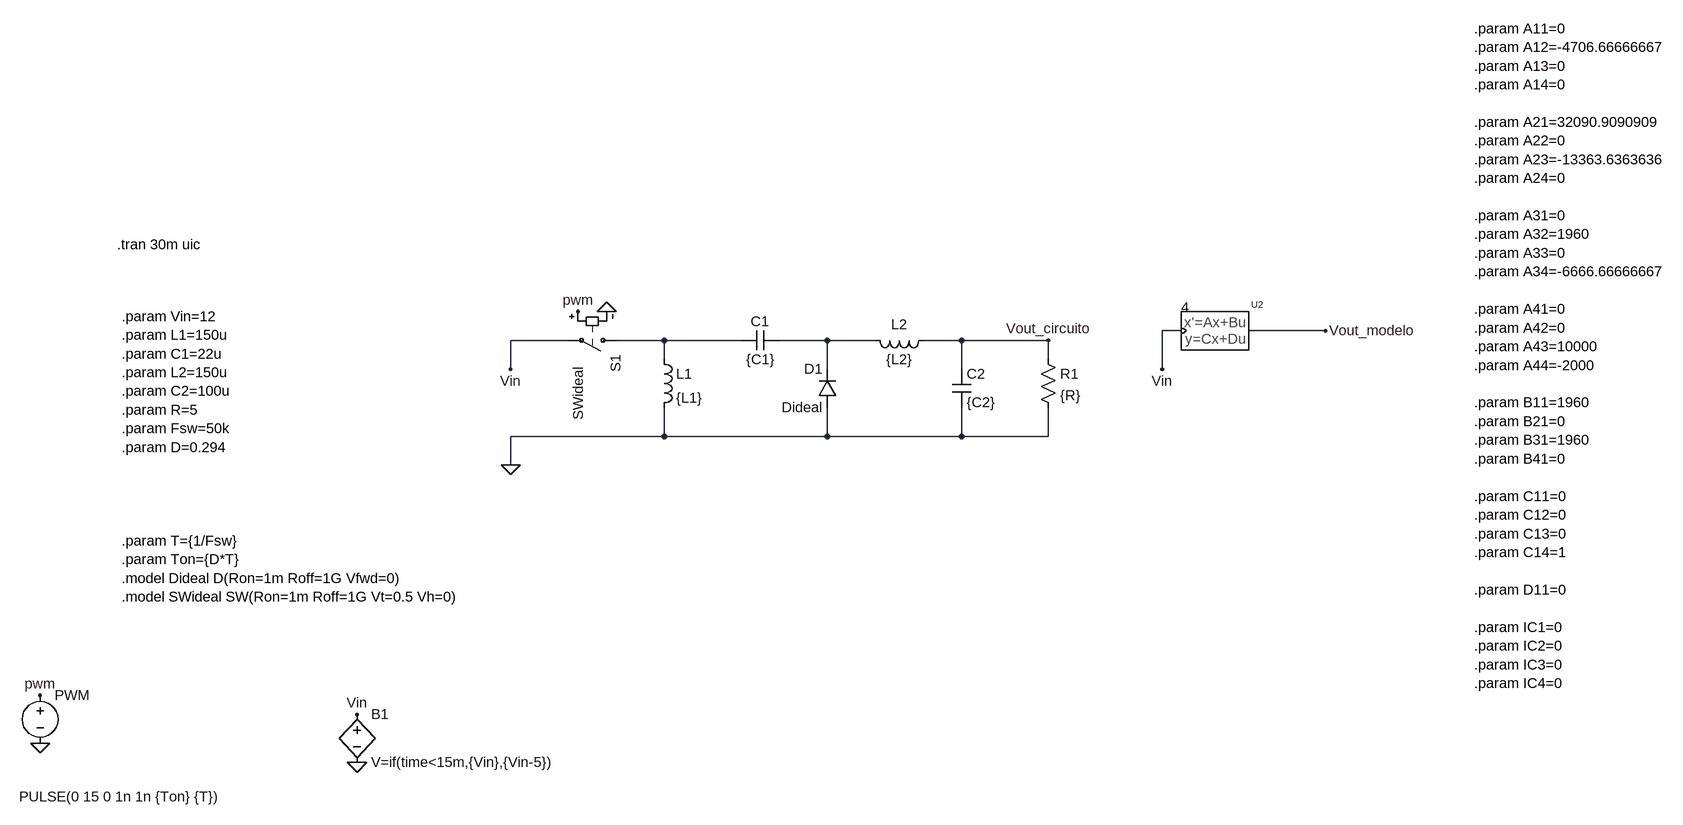
[diagram p0: schematic zeta.asc]
zeta.asc, the LTspice schematic file:
Version 4
SHEET 1 2188 876
WIRE 1184 80 1152 80
WIRE 1424 80 1296 80
WIRE -208 96 -304 96
WIRE -48 96 -128 96
WIRE 80 96 -48 96
WIRE 224 96 144 96
WIRE 304 96 224 96
WIRE 448 96 384 96
WIRE 592 96 448 96
WIRE -48 128 -48 96
WIRE 592 128 592 96
WIRE -304 144 -304 96
WIRE 224 144 224 96
WIRE 448 144 448 96
WIRE 1152 144 1152 80
WIRE -48 256 -48 208
WIRE -48 256 -304 256
WIRE 224 256 224 208
WIRE 224 256 -48 256
WIRE 448 256 448 208
WIRE 448 256 224 256
WIRE 592 256 592 208
WIRE 592 256 448 256
WIRE -304 304 -304 256
FLAG -304 304 0
FLAG -1088 688 pwm
FLAG -1088 768 0
FLAG 592 96 Vout_circuito
FLAG 1424 80 Vout_modelo
FLAG -144 48 0
FLAG -192 48 pwm
FLAG -304 144 Vin
FLAG 1152 144 Vin
FLAG -560 800 0
FLAG -560 720 Vin
SYMBOL diode 240 208 R180
WINDOW 0 24 64 Left 2
WINDOW 3 24 0 Left 2
SYMATTR InstName D1
SYMATTR Value Dideal
SYMBOL ind -64 112 R0
SYMATTR InstName L1
SYMATTR Value {L1}
SYMBOL cap 80 112 R270
WINDOW 0 32 32 VTop 2
WINDOW 3 0 32 VBottom 2
SYMATTR InstName C1
SYMATTR Value {C1}
SYMBOL voltage -1088 672 R0
WINDOW 3 -35 185 Left 2
WINDOW 123 0 0 Left 0
WINDOW 39 0 0 Left 0
SYMATTR Value PULSE(0 15 0 1n 1n {Ton} {T})
SYMATTR InstName PWM
SYMBOL res 576 112 R0
SYMATTR InstName R1
SYMATTR Value {R}
SYMBOL sw -112 96 R90
WINDOW 3 133 79 Right 2
SYMATTR Value SWideal
SYMATTR InstName S1
SYMBOL bv -560 704 R0
SYMATTR InstName B1
SYMATTR Value V=if(time<15m,{Vin},{Vin-5})
SYMBOL ind 400 80 R90
WINDOW 0 5 56 VBottom 2
WINDOW 3 32 56 VTop 2
SYMATTR InstName L2
SYMATTR Value {L2}
SYMBOL cap 432 144 R0
SYMATTR InstName C2
SYMATTR Value {C2}
SYMBOL StateSpace4 1248 80 R0
SYMATTR InstName U2
TEXT -952 56 Left 2 !.param Vin=12\n.param L1=150u\n.param C1=22u\n.param L2=150u\n.param C2=100u\n.param R=5\n.param Fsw=50k\n.param D=0.294\n \n \n \n \n.param T={1/Fsw}\n.param Ton={D*T}\n.model Dideal D(Ron=1m Roff=1G Vfwd=0)\n.model SWideal SW(Ron=1m Roff=1G Vt=0.5 Vh=0)
TEXT -960 -64 Left 2 !.tran 30m uic
TEXT 1840 -424 Left 2 !.param A11=0\n.param A12=-4706.66666667\n.param A13=0\n.param A14=0\n \n.param A21=32090.9090909\n.param A22=0\n.param A23=-13363.6363636\n.param A24=0\n \n.param A31=0\n.param A32=1960\n.param A33=0\n.param A34=-6666.66666667\n \n.param A41=0\n.param A42=0\n.param A43=10000\n.param A44=-2000\n \n.param B11=1960\n.param B21=0\n.param B31=1960\n.param B41=0\n \n.param C11=0\n.param C12=0\n.param C13=0\n.param C14=1\n \n.param D11=0\n \n.param IC1=0\n.param IC2=0\n.param IC3=0\n.param IC4=0

The netlist it stands for:
* zeta.asc
D1 0 N002 Dideal
L1 N001 0 {L1}
C1 N001 N002 {C1}
V§PWM pwm 0 PULSE(0 15 0 1n 1n {Ton} {T})
R1 Vout_circuito 0 {R}
S1 N001 Vin pwm 0 SWideal
B1 Vin 0 V=if(time<15m,{Vin},{Vin-5})
L2 Vout_circuito N002 {L2}
C2 Vout_circuito 0 {C2}
XU2 Vin Vout_modelo 4 A11={A11} A12={A12} A13={A13} A14={A14} B11={B11} A21={A21} A22={A22} A23={A23} A24={A24} B21={B21} A31={A31} A32={A32} A33={A33} A34={A34} B31={B31} A41={A41} A42={A42} A43={A43} A44={A44} B41={B41} C11={C11} C12={C12} C13={C13} C14={C14} D11={D11} ic1={IC1} ic2={IC2} ic3={IC3} ic4={IC4}  ; pins in out
.model D D
.lib standard.dio
.param Vin=12
.param L1=150u
.param C1=22u
.param L2=150u
.param C2=100u
.param R=5
.param Fsw=50k
.param D=0.294
.param T={1/Fsw}
.param Ton={D*T}
.model Dideal D(Ron=1m Roff=1G Vfwd=0)
.model SWideal SW(Ron=1m Roff=1G Vt=0.5 Vh=0)
.tran 30m uic
.param A11=0
.param A12=-4706.66666667
.param A13=0
.param A14=0
.param A21=32090.9090909
.param A22=0
.param A23=-13363.6363636
.param A24=0
.param A31=0
.param A32=1960
.param A33=0
.param A34=-6666.66666667
.param A41=0
.param A42=0
.param A43=10000
.param A44=-2000
.param B11=1960
.param B21=0
.param B31=1960
.param B41=0
.param C11=0
.param C12=0
.param C13=0
.param C14=1
.param D11=0
.param IC1=0
.param IC2=0
.param IC3=0
.param IC4=0
.lib statespace.sub
.backanno
.end

* Results of the author's LTspice run, read from the files saved beside the schematic
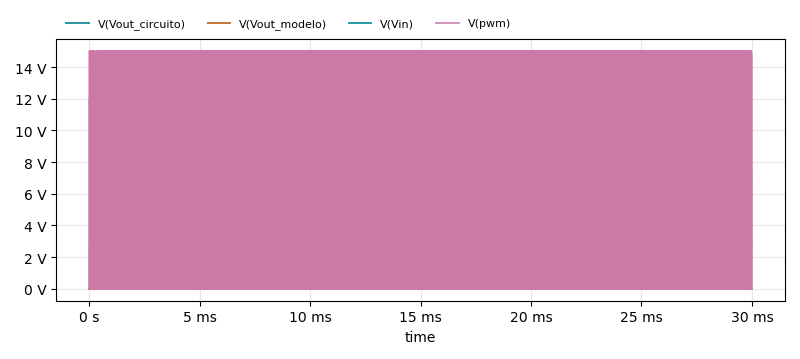
[diagram p1: Transient Analysis of zeta.asc, plotted from the saved traces]
* Transient Analysis, 1 run:
*   V(Vout_circuito): min 0 V, max 8.688 V, average 3.975 V, rms 4.135 V, last 2.91 V
*   V(Vout_modelo): min 0 V, max 8.701 V, average 3.953 V, rms 4.124 V, last 2.906 V
*   V(Vin): min 0 V, max 12 V, average 9.5 V, rms 9.823 V, last 7 V
*   V(pwm): min 0 V, max 15 V, average 4.411 V, rms 8.134 V, last 0 V